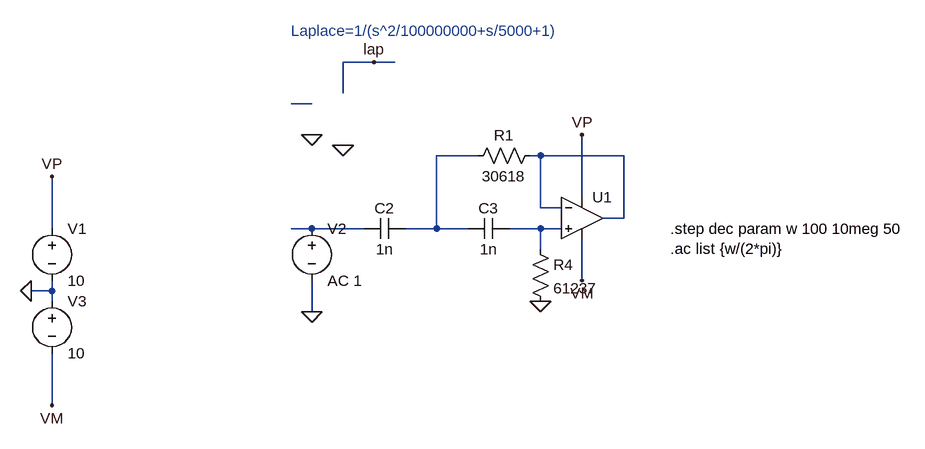
[diagram p0: schematic butterworth_2_HP.asc]
butterworth_2_HP.asc, the LTspice schematic file:
Version 4
SHEET 1 1020 680
WIRE 160 -48 112 -48
WIRE 192 -48 160 -48
WIRE 112 0 112 -48
WIRE 64 16 32 16
WIRE 320 96 256 96
WIRE 416 96 400 96
WIRE 544 96 416 96
WIRE 480 160 480 64
WIRE 416 176 416 96
WIRE 448 176 416 176
WIRE 544 192 544 96
WIRE 544 192 512 192
WIRE -336 208 -336 128
WIRE 64 208 32 208
WIRE 144 208 64 208
WIRE 256 208 256 96
WIRE 256 208 208 208
WIRE 304 208 256 208
WIRE 416 208 368 208
WIRE 448 208 416 208
WIRE 416 240 416 208
WIRE 480 288 480 224
WIRE -336 304 -336 288
WIRE -336 304 -368 304
WIRE -336 320 -336 304
WIRE 64 336 64 288
WIRE -336 480 -336 400
FLAG 64 336 0
FLAG -368 304 0
FLAG 416 320 0
FLAG -336 128 VP
FLAG -336 480 VM
FLAG 480 64 VP
FLAG 480 288 VM
FLAG 112 80 0
FLAG 64 64 0
FLAG 160 -48 lap
SYMBOL Opamps\\UniversalOpamp2 480 192 R0
SYMATTR InstName U1
SYMATTR SpiceModel level.1
SYMBOL voltage -336 192 R0
WINDOW 123 0 0 Left 0
WINDOW 39 0 0 Left 0
SYMATTR InstName V1
SYMATTR Value 10
SYMBOL voltage 64 192 R0
WINDOW 123 0 0 Left 0
WINDOW 39 0 0 Left 0
SYMATTR InstName V2
SYMATTR Value AC 1
SYMBOL voltage -336 304 R0
WINDOW 123 0 0 Left 0
WINDOW 39 0 0 Left 0
SYMATTR InstName V3
SYMATTR Value 10
SYMBOL cap 208 192 R90
WINDOW 0 0 32 VBottom 0
WINDOW 3 32 32 VTop 0
SYMATTR InstName C2
SYMATTR Value 1n
SYMBOL cap 368 192 R90
WINDOW 0 0 32 VBottom 0
WINDOW 3 32 32 VTop 0
SYMATTR InstName C3
SYMATTR Value 1n
SYMBOL res 400 224 R0
SYMATTR InstName R4
SYMATTR Value 61237
SYMBOL res 416 80 R90
WINDOW 0 0 56 VBottom 0
WINDOW 3 32 56 VTop 0
SYMATTR InstName R1
SYMATTR Value 30618
TEXT 616 208 Left 0 !.step dec param w 100 10meg 50\n.ac list {w/(2*pi)}
TEXT 32 -96 Left 0 ;Laplace=1/(s^2/100000000+s/5000+1)

The netlist it stands for:
* butterworth_2_HP.asc
XU1 N005 N003 VP VM N003 level.1 Avol=1Meg GBW=10Meg Slew=10Meg ilimit=25m rail=0 Vos=0 phimargin=45 en=0 enk=0 in=0 ink=0 Rin=500Meg  ; pins IN+ IN- V+ V- OUT
V1 VP 0 10
V2 N004 0 AC 1
V3 0 VM 10
C2 N002 N004 1n
C3 N005 N002 1n
R4 N005 0 61237
R1 N003 N002 30618
.step dec param w 100 10meg 50
.ac list {w/(2*pi)}
* Laplace=1/(s^2/100000000+s/5000+1)
.lib UniversalOpamps2.sub
.backanno
.end